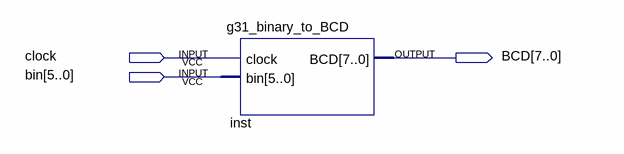
[diagram p0: schematic sheet]
// Quartus schematic g31_binary_to_BCD_circuit.bdf as structural Verilog: 1 symbols, 3 pins
module g31_binary_to_BCD_circuit (
  input  clock,
  input  [5:0] bin,
  output [7:0] BCD
);

  g31_binary_to_BCD inst (.clock(clock), .bin(bin), .BCD(BCD));
endmodule
